# Altium schematic sheet ADC_Header_ 8.SchDoc
size A4
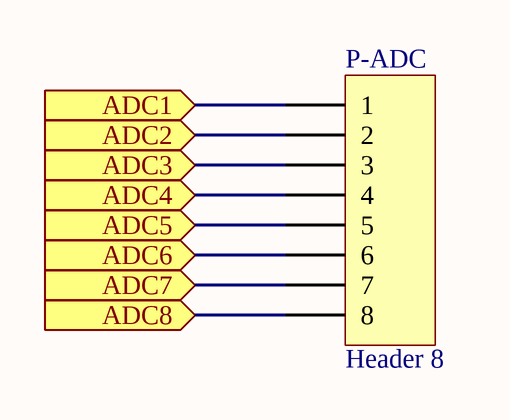
[diagram p0: ADC_Header_ 8.SchDoc]

## Parts
P-ADC  Header 8  [HDR1X8]

## Ports
ADC1, ADC2, ADC3, ADC4, ADC5, ADC6, ADC7, ADC8

## Nets
ADC1: P-ADC.1 ; port ADC1
ADC2: P-ADC.2 ; port ADC2
ADC3: P-ADC.3 ; port ADC3
ADC4: P-ADC.4 ; port ADC4
ADC5: P-ADC.5 ; port ADC5
ADC6: P-ADC.6 ; port ADC6
ADC7: P-ADC.7 ; port ADC7
ADC8: P-ADC.8 ; port ADC8

## Library data of the parts
P-ADC = Header 8: Header, 8-Pin; LatestRevisionDate: 17-Jul-2002; LatestRevisionNote: Re-released for DXP Platform.; Publisher: Altium Limited